# Altium project MU-RK3576J-MB.PrjPCB (part 6 of 13)

## Sheet VIDEO.SchDoc
size 420 x 297 mm; SheetNumber: 18; SheetTotal: 32; DocumentTypeShort: Э3; DocumentInvertoryNumber: ㅤ
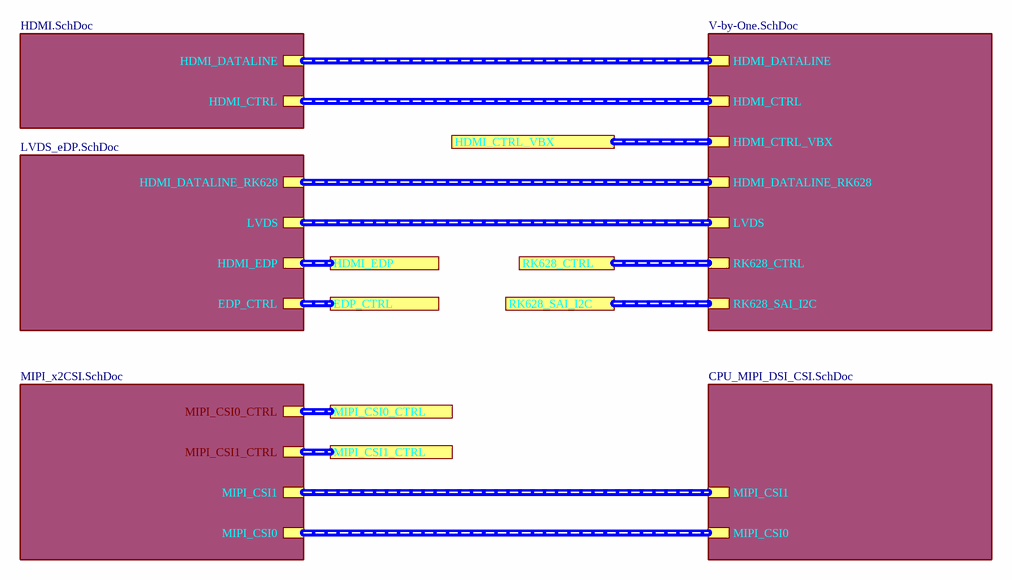
[diagram p14: VIDEO.SchDoc]

### Sub-sheets
CPU_MIPI_DSI_CSI = CPU_MIPI_DSI_CSI.SchDoc: MIPI_CSI1 (harness MIPI_CSI1), MIPI_CSI0 (harness MIPI_CSI0)
HDMI = HDMI.SchDoc: HDMI_DATALINE (harness HDMI_DATALINE), HDMI_CTRL (harness HDMI_CTRL)
LVDS_eDP = LVDS_eDP.SchDoc: LVDS (harness LVDS), HDMI_DATALINE_RK628 (harness HDMI_DATALINE_RK628), HDMI_EDP (harness HDMI_EDP), EDP_CTRL (harness EDP_CTRL)
MIPI_x2CSI = MIPI_x2CSI.SchDoc: MIPI_CSI1 (harness MIPI_CSI1), MIPI_CSI0 (harness MIPI_CSI0), MIPI_CSI0_CTRL (harness MIPI_CSI0_CTRL), MIPI_CSI1_CTRL (harness MIPI_CSI1_CTRL)
V-by-One.Sch = V-by-One.SchDoc: HDMI_CTRL (harness HDMI_CTRL), HDMI_DATALINE (harness HDMI_DATALINE), HDMI_CTRL_VBX (harness HDMI_CTRL_VBX), LVDS (harness LVDS), HDMI_DATALINE_RK628 (harness HDMI_DATALINE_RK628), RK628_SAI_I2C (harness RK628_SAI_I2C), RK628_CTRL (harness RK628_CTRL)

### Ports
EDP_CTRL, HDMI_CTRL_VBX, HDMI_EDP, MIPI_CSI0_CTRL, MIPI_CSI1_CTRL, RK628_CTRL, RK628_SAI_I2C

### Buses and harness runs
harness port EDP_CTRL = sheet LVDS_eDP/EDP_CTRL
harness port HDMI_CTRL_VBX = sheet V-by-One.Sch/HDMI_CTRL_VBX
harness port HDMI_EDP = sheet LVDS_eDP/HDMI_EDP
harness port MIPI_CSI0_CTRL = sheet MIPI_x2CSI/MIPI_CSI0_CTRL
harness port MIPI_CSI1_CTRL = sheet MIPI_x2CSI/MIPI_CSI1_CTRL
harness port RK628_CTRL = sheet V-by-One.Sch/RK628_CTRL
harness port RK628_SAI_I2C = sheet V-by-One.Sch/RK628_SAI_I2C
harness sheet CPU_MIPI_DSI_CSI/MIPI_CSI0 = sheet MIPI_x2CSI/MIPI_CSI0
harness sheet CPU_MIPI_DSI_CSI/MIPI_CSI1 = sheet MIPI_x2CSI/MIPI_CSI1
harness sheet HDMI/HDMI_CTRL = sheet V-by-One.Sch/HDMI_CTRL
harness sheet HDMI/HDMI_DATALINE = sheet V-by-One.Sch/HDMI_DATALINE
harness sheet LVDS_eDP/HDMI_DATALINE_RK628 = sheet V-by-One.Sch/HDMI_DATALINE_RK628
harness sheet LVDS_eDP/LVDS = sheet V-by-One.Sch/LVDS

### Notes on the sheet
- Подп. и дата
- Инв. № дубл.
- Взам. инв. №
- Инв. № подл.
- Изм.
- Лист
- № докум.
- Подп.
- Дата
- Копировал
- Формат А3

## Sheet HDMI.SchDoc
size 420 x 297 mm; Scale: 1:1; DocumentType: Схема электрическая принципиальная; SheetNumber: 19; SheetTotal: 32; DocumentTypeShort: Э3; DocumentInvertoryNumber: ㅤ
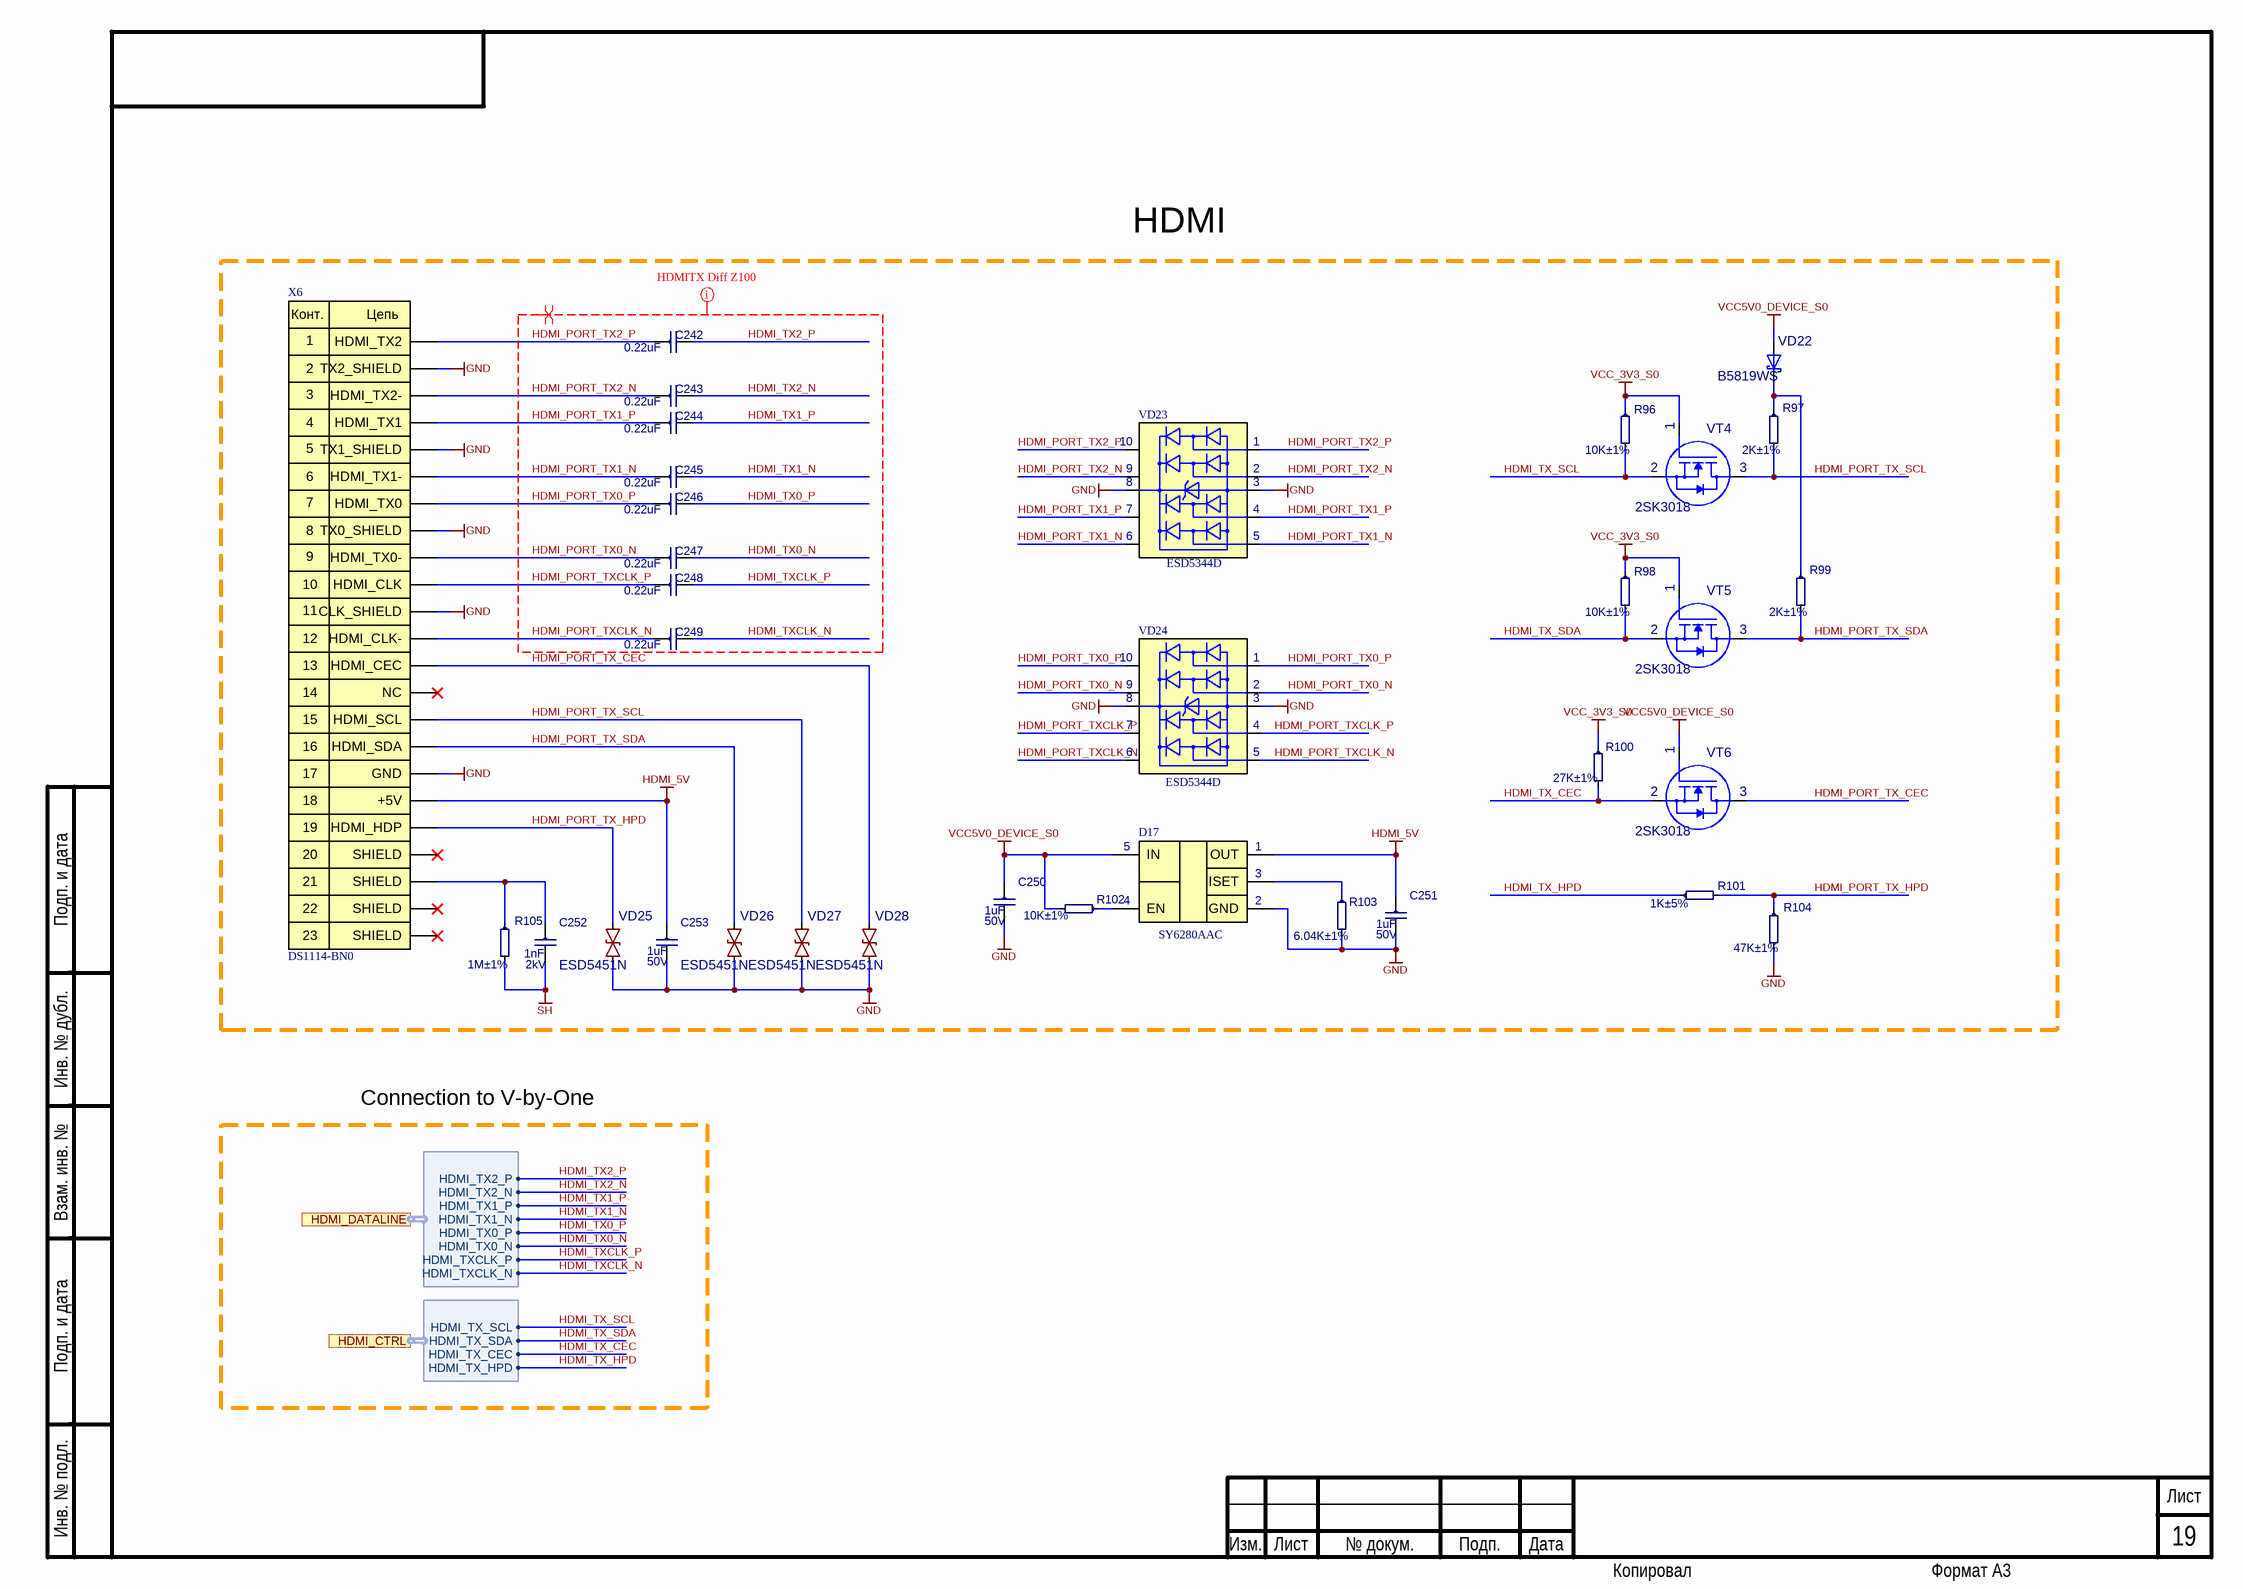
[diagram p15: HDMI.SchDoc]

### Parts
C242  0.22uF  [C0201]
C243  0.22uF  [C0201]
C244  0.22uF  [C0201]
C245  0.22uF  [C0201]
C246  0.22uF  [C0201]
C247  0.22uF  [C0201]
C248  0.22uF  [C0201]
C249  0.22uF  [C0201]
C250  1uF  Voltage: 50V  [C0402]
C251  1uF  Voltage: 50V  [C0402]
C252  1nF  Voltage: 2kV  [C1812]
C253  1uF  Voltage: 50V  [C0402]
D17  SY6280AAC  [SY6280AAC]
R96  10K±1%  [R0402]
R97  2K±1%  [R0402]
R98  10K±1%  [R0402]
R99  2K±1%  [R0402]
R100  27K±1%  [R0402]
R101  1K±5%  [R0402]
R102  10K±1%  [R0402]
R103  6.04K±1%  [R0402]
R104  47K±1%  [R0402]
R105  1M±1%  [R1206]
VD22  B5819WS  [B5819WS]
VD23  ESD5344D  [ESD5344D]
VD24  ESD5344D  [ESD5344D]
VD25  ESD5451N  [DFN_1006_2]
VD26  ESD5451N  [DFN_1006_2]
VD27  ESD5451N  [DFN_1006_2]
VD28  ESD5451N  [DFN_1006_2]
VT4  2SK3018  [2SK3018]
VT5  2SK3018  [2SK3018]
VT6  2SK3018  [2SK3018]
X6  DS1114-BN0  [DS1114-BN0]

### Ports
HDMI_CTRL (harness HDMI_CTRL), HDMI_DATALINE (harness HDMI_DATALINE)

### Harnesses
HDMI_DATALINE: HDMI_TX2_N, HDMI_TX1_P, HDMI_TX1_N, HDMI_TX2_P, HDMI_TX0_P, HDMI_TX0_N, HDMI_TXCLK_P, HDMI_TXCLK_N
HDMI_CTRL: HDMI_TX_SDA, HDMI_TX_CEC, HDMI_TX_HPD, HDMI_TX_SCL

### Nets
GND: C250.2 C251.2 C253.2 D17.2(GND) R103.2 R104.2 VD23.3 VD23.8 VD24.3 VD24.8 VD25.2 VD26.2 VD27.2 VD28.2 X6.2(TX2_SHIELD) X6.5(TX1_SHIELD) X6.8(TX0_SHIELD) X6.11(CLK_SHIELD) X6.17(GND)
HDMI_5V: C251.1 C253.1 D17.1(OUT) X6.18(+5V)
SH: C252.2 R105.2
VCC5V0_DEVICE_S0: C250.1 D17.5(IN) R102.2 VD22.2(A) VT6.1(G)
VCC_3V3_S0: R96.1 R98.1 R100.1 VT4.1(G) VT5.1(G)
HDMI_PORT_TX0_N: C247.1 VD24.2 VD24.9 X6.9(HDMI_TX0-)
HDMI_PORT_TX0_P: C246.1 VD24.1 VD24.10 X6.7(HDMI_TX0)
HDMI_PORT_TX1_N: C245.1 VD23.5 VD23.6 X6.6(HDMI_TX1-)
HDMI_PORT_TX1_P: C244.1 VD23.4 VD23.7 X6.4(HDMI_TX1)
HDMI_PORT_TX2_N: C243.1 VD23.2 VD23.9 X6.3(HDMI_TX2-)
HDMI_PORT_TX2_P: C242.1 VD23.1 VD23.10 X6.1(HDMI_TX2)
HDMI_PORT_TX_CEC: VD28.1 VT6.3(D) X6.13(HDMI_CEC)
HDMI_PORT_TX_HPD: R101.2 R104.1 VD25.1 X6.19(HDMI_HDP)
HDMI_PORT_TX_SCL: R97.2 VD27.1 VT4.3(D) X6.15(HDMI_SCL)
HDMI_PORT_TX_SDA: R99.2 VD26.1 VT5.3(D) X6.16(HDMI_SDA)
HDMI_PORT_TXCLK_N: C249.1 VD24.5 VD24.6 X6.12(HDMI_CLK-)
HDMI_PORT_TXCLK_P: C248.1 VD24.4 VD24.7 X6.10(HDMI_CLK)
HDMI_TX0_N: C247.2 ; port HDMI_DATALINE.HDMI_TX0_N
HDMI_TX0_P: C246.2 ; port HDMI_DATALINE.HDMI_TX0_P
HDMI_TX1_N: C245.2 ; port HDMI_DATALINE.HDMI_TX1_N
HDMI_TX1_P: C244.2 ; port HDMI_DATALINE.HDMI_TX1_P
HDMI_TX2_N: C243.2 ; port HDMI_DATALINE.HDMI_TX2_N
HDMI_TX2_P: C242.2 ; port HDMI_DATALINE.HDMI_TX2_P
HDMI_TX_CEC: R100.2 VT6.2(S) ; port HDMI_CTRL.HDMI_TX_CEC
HDMI_TX_HPD: R101.1 ; port HDMI_CTRL.HDMI_TX_HPD
HDMI_TX_SCL: R96.2 VT4.2(S) ; port HDMI_CTRL.HDMI_TX_SCL
HDMI_TX_SDA: R98.2 VT5.2(S) ; port HDMI_CTRL.HDMI_TX_SDA
HDMI_TXCLK_N: C249.2 ; port HDMI_DATALINE.HDMI_TXCLK_N
HDMI_TXCLK_P: C248.2 ; port HDMI_DATALINE.HDMI_TXCLK_P
NetC252_1: C252.1 R105.1 X6.21(SHIELD)
NetD17_3: D17.3(ISET) R103.1
NetD17_4: D17.4(EN) R102.1
NetR97_1: R97.1 R99.1 VD22.1(K)

Not connected (* = marked no-connect by the designer): X6 14(NC)* 20(SHIELD)* 22(SHIELD)* 23(SHIELD)*

### Layout directives
net class HDMITX: HDMI_PORT_TX0_N, HDMI_PORT_TX0_P, HDMI_PORT_TX1_N, HDMI_PORT_TX1_P, HDMI_PORT_TX2_N, HDMI_PORT_TX2_P, HDMI_PORT_TXCLK_N, HDMI_PORT_TXCLK_P, HDMI_TX0_N, HDMI_TX0_P, HDMI_TX1_N, HDMI_TX1_P, HDMI_TX2_N, HDMI_TX2_P, HDMI_TXCLK_N, HDMI_TXCLK_P
differential pair; differential pair class Diff_Z100: HDMI_PORT_TX0_N, HDMI_PORT_TX0_P, HDMI_PORT_TX1_N, HDMI_PORT_TX1_P, HDMI_PORT_TX2_N, HDMI_PORT_TX2_P, HDMI_PORT_TXCLK_N, HDMI_PORT_TXCLK_P, HDMI_TX0_N, HDMI_TX0_P, HDMI_TX1_N, HDMI_TX1_P, HDMI_TX2_N, HDMI_TX2_P, HDMI_TXCLK_N, HDMI_TXCLK_P

### Notes on the sheet
- HDMI
- Connection to V-by-One
- Подп. и дата
- Инв. № дубл.
- Взам. инв. №
- Инв. № подл.
- Изм.
- Лист
- № докум.
- Подп.
- Дата
- Копировал
- Формат А3
- (in symbol DS1114-BN0) Конт.; Цепь

### Library data of the parts
C242-C249 = 0201-C0G-25V-100pF±5%: *; Part Number: 0201-X5R-10V-220nF±10%; Manufacturer: Yageo; NameFromManufacturer: CC0201KRX5R6BB224; Dielectric: C0G; Voltage: 10V; Place: *); Tolerance: 5%; Check: False; Case: C0201; Value: 0.22uF; Temperature: -55°C~125°C; ComponentLink2Description: Link to datasheet; ComponentLink1Description: DATASHEET; ComponentLink2URL: https://ru.mouser.com/ProductDetail/YAGEO/CC0201JRNPO8BN101?qs=%2Fha2pyFaduhl6p6a7Jtfij5kOT7C0BCbN0eDEcSOi5wWtTVDmUsGTw%3D%3D; ComponentLink1URL: Datasheets/capacitors/UPY-GP_NP0_16V-to-50V_18.pdf; Last changed: 27.10.2022
C250 C251 C253 = 0402-X5R-50V-1uF±10%: Ceramic Capacitor 0402 1uF ±10% 50V X5R; Manufacturer: Yageo; NameFromManufacturer: CC0402KRX5R9BB105; Place: *); Check: False; Dielectric: X5R; Case: C0402; Part Number: 0402-X5R-50V-1uF±10%; Value: 1uF; Tolerance: 10%; Temperature: -55°C~85°C; ComponentLink2Description: Link to datasheet; ComponentLink1Description: DATASHEET; ComponentLink2URL: https://www.lcsc.com/product-detail/Multilayer-Ceramic-Capacitors-MLCC-SMD-SMT_YAGEO-CC0402KRX5R9BB105_C7500380.html; Last changed: 09.04.2025
C252 = 1812-C0G-2kV-1uF±10%: *; Part Number: 1812-C0G-2kV-1nF±10%; Manufacturer: FH; NameFromManufacturer: 1812B102K202NT; Dielectric: C0G; Place: *); Tolerance: 5%; Check: False; Case: CASE; Value: 1nF; Temperature: -55°C~125°C; ComponentLink2Description: Link to datasheet; ComponentLink1Description: DATASHEET; ComponentLink2URL: https://octopart.com/1812ga102jat2a-avx-75165070?r=sp; ComponentLink1URL: Datasheets/capacitors/C0GNP0-Dielectric.pdf; Last changed: 27.10.2022
D17 = SY6280AAC: Power Distribution Switches; Manufacturer: Silergy Corp; Check: False; Part Number: SY6280AAC; NameFromManufacturer: SY6280AAC; Value: SY6280AAC; ComponentLink1Description: DATASHEET; Last changed: 24.03.2023
R96 R98 R102 = 0402-0.0625W-10K-100ppm±1%: as R2 on sheet IC_LPDDR4; Case: R0402; Part Number: 0402-0.0625W-10K-100ppm±1%; Tolerance: 1%; Temperature: -55°C~155°C; ComponentLink1Description: DATASHEET; ComponentLink1URL: https://ru.mouser.com/ProductDetail/YAGEO/RC0402FR-0710KL?qs=%2Fha2pyFaduhjtLcYvKXQ8IogF7YwN7YtH%252BOO8ZtEEMnoa4yoWYcwpw%3D%3D; Datasheet: Datasheets/resistors/PYu-RC_Group_51_RoHS_L_11.pdf; Last changed: 27.10.2022
R97 R99 = 0402-0.0625W-2K-100ppm±1%: NameFromManufacturer: RC0402FR-072KL; Manufacturer: Yageo; Place: *); Value: 2K; Tolerance: 1%; Check: False; Case: R0402; Part Number: 0402-0.0625W-2K-100ppm±1%; Temperature: -55°C~155°C; ComponentLink1Description: DATASHEET; ComponentLink1URL: https://ru.mouser.com/ProductDetail/YAGEO/RC0402FR-072KL?qs=%2Fha2pyFaduhjtLcYvKXQ8CqCkWjwqUqgtfrQweQcV7%252BeDonvCaUsqQ%3D%3D; Datasheet: Datasheets/resistors/PYu-RC_Group_51_RoHS_L_11.pdf; Last changed: 27.10.2022
R100 = 0402-0.0625W-27K-100ppm±1%: NameFromManufacturer: RC0402FR-0727KL; Manufacturer: Yageo; Place: *); Value: 27K; Tolerance: 1%; Check: False; Case: R0402; Part Number: 0402-0.0625W-27K-100ppm±1%; Temperature: -55°C~155°C; ComponentLink1Description: DATASHEET; ComponentLink1URL: https://eu.mouser.com/ProductDetail/YAGEO/RC0402FR-0727KL?qs=UOUeRUa%252B8Wnc61O5LQjN8Q%3D%3D; Datasheet: Datasheets/resistors/PYu-RC_Group_51_RoHS_L_11.pdf; Last changed: 27.10.2022
R101 = 0402-0.0625W-1K-100ppm±5%: as R68 on sheet Flash_eMMC_MicroSD; Case: R0402; Part Number: 0402-0.0625W-1K-100ppm±5%; Temperature: -55°C~155°C; ComponentLink1Description: DATASHEET; ComponentLink1URL: https://ru.mouser.com/ProductDetail/YAGEO/RC0402JR-071KL?qs=%2Fha2pyFadugNN0LzwXn2qBG%2Fxv0pCy6gh7Z%252B1hZJT2CnjLeHVORGDQ%3D%3D; Datasheet: Datasheets/resistors/PYu-RC_Group_51_RoHS_L_11.pdf; Last changed: 27.10.2022
R103 = 0402-0.0625W-6.04K-100ppm±1%: NameFromManufacturer: RC0402FR-076K04L; Manufacturer: Yageo; Place: *); Value: 6.04K; Tolerance: 1%; Check: False; Case: R0402; Part Number: 0402-0.0625W-6.04K-100ppm±1%; Temperature: -55°C~155°C; ComponentLink1Description: DATASHEET; ComponentLink1URL: https://www.electronshik.ru/item/YAG/RC0402FR-076K04L; Datasheet: Datasheets/resistors/PYu-RC_Group_51_RoHS_L_11.pdf; Last changed: 18.11.2022
R104 = 0402-0.0625W-47K-100ppm±1%: as R70 on sheet Flash_eMMC_MicroSD; Case: R0402; Part Number: 0402-0.0625W-47K-100ppm±1%; Temperature: -55°C~155°C; ComponentLink1Description: DATASHEET; ComponentLink1URL: https://www.terraelectronica.ru/pdf/show?pdf_file=%252Fds%252Fpdf%252FR%252FRC0402.pdf; Datasheet: Datasheets/resistors/PYu-RC_Group_51_RoHS_L_12.pdf; Last changed: 27.10.2022
R105 = 1206-0.25W-1M-100ppm±1%: Chip Resistor 1206 1MΩ ±1% 200V ±100ppm/℃ Thick Film; NameFromManufacturer: RC1206FR-071ML; Manufacturer: Yageo; Place: *); Value: 1M; Check: False; Case: R1206; Part Number: 1206-0.25W-1M-100ppm±1%; Tolerance: 1%; Temperature: -55°C~155°C; ComponentLink1Description: DATASHEET; ComponentLink1URL: https://www.lcsc.com/product-detail/Chip-Resistor-Surface-Mount_YAGEO-RC1206FR-071ML_C108083.html?s_z=n_RC1206FR-071ML; Last changed: 09.04.2025
VD22 = B5819WS: Manufacturer: MDD; Check: False; Part Number: B5819WS; Value: B5819WS; NameFromManufacturer: B5819WS
VD23 VD24 = ESD5344D: Manufacturer: KUU; Check: False; Part Number: ESD5344D; Value: ESD5344D; NameFromManufacturer: ESD5344D
VD25-VD28 = ESD5451N: as VD11 on sheet Flash_eMMC_MicroSD; Part Number: ESD5451N; Value: ESD5451N; Temperature: -65°C~150°C; ComponentLink1Description: DATASHEET; NameFromManufacturer: ESD5451N; Last changed: 13.04.2023
VT4-VT6 = 2SK3018: N-Channel; Manufacturer: KUU; Check: False; Part Number: 2SK3018; Value: 2SK3018; NameFromManufacturer: 2SK3018
X6 = DS1114-BN0: Manufacturer: CONNFLY; Check: False; Part Number: DS1114-BN0; NameFromManufacturer: DS1114-BN0; Value: DS1114-BN0

## Sheet CPU_MIPI_DSI_CSI.SchDoc
size 420 x 297 mm; Scale: 1:1; DocumentType: Схема электрическая принципиальная; SheetNumber: 20; SheetTotal: 32; DocumentTypeShort: Э3; DocumentInvertoryNumber: ㅤ
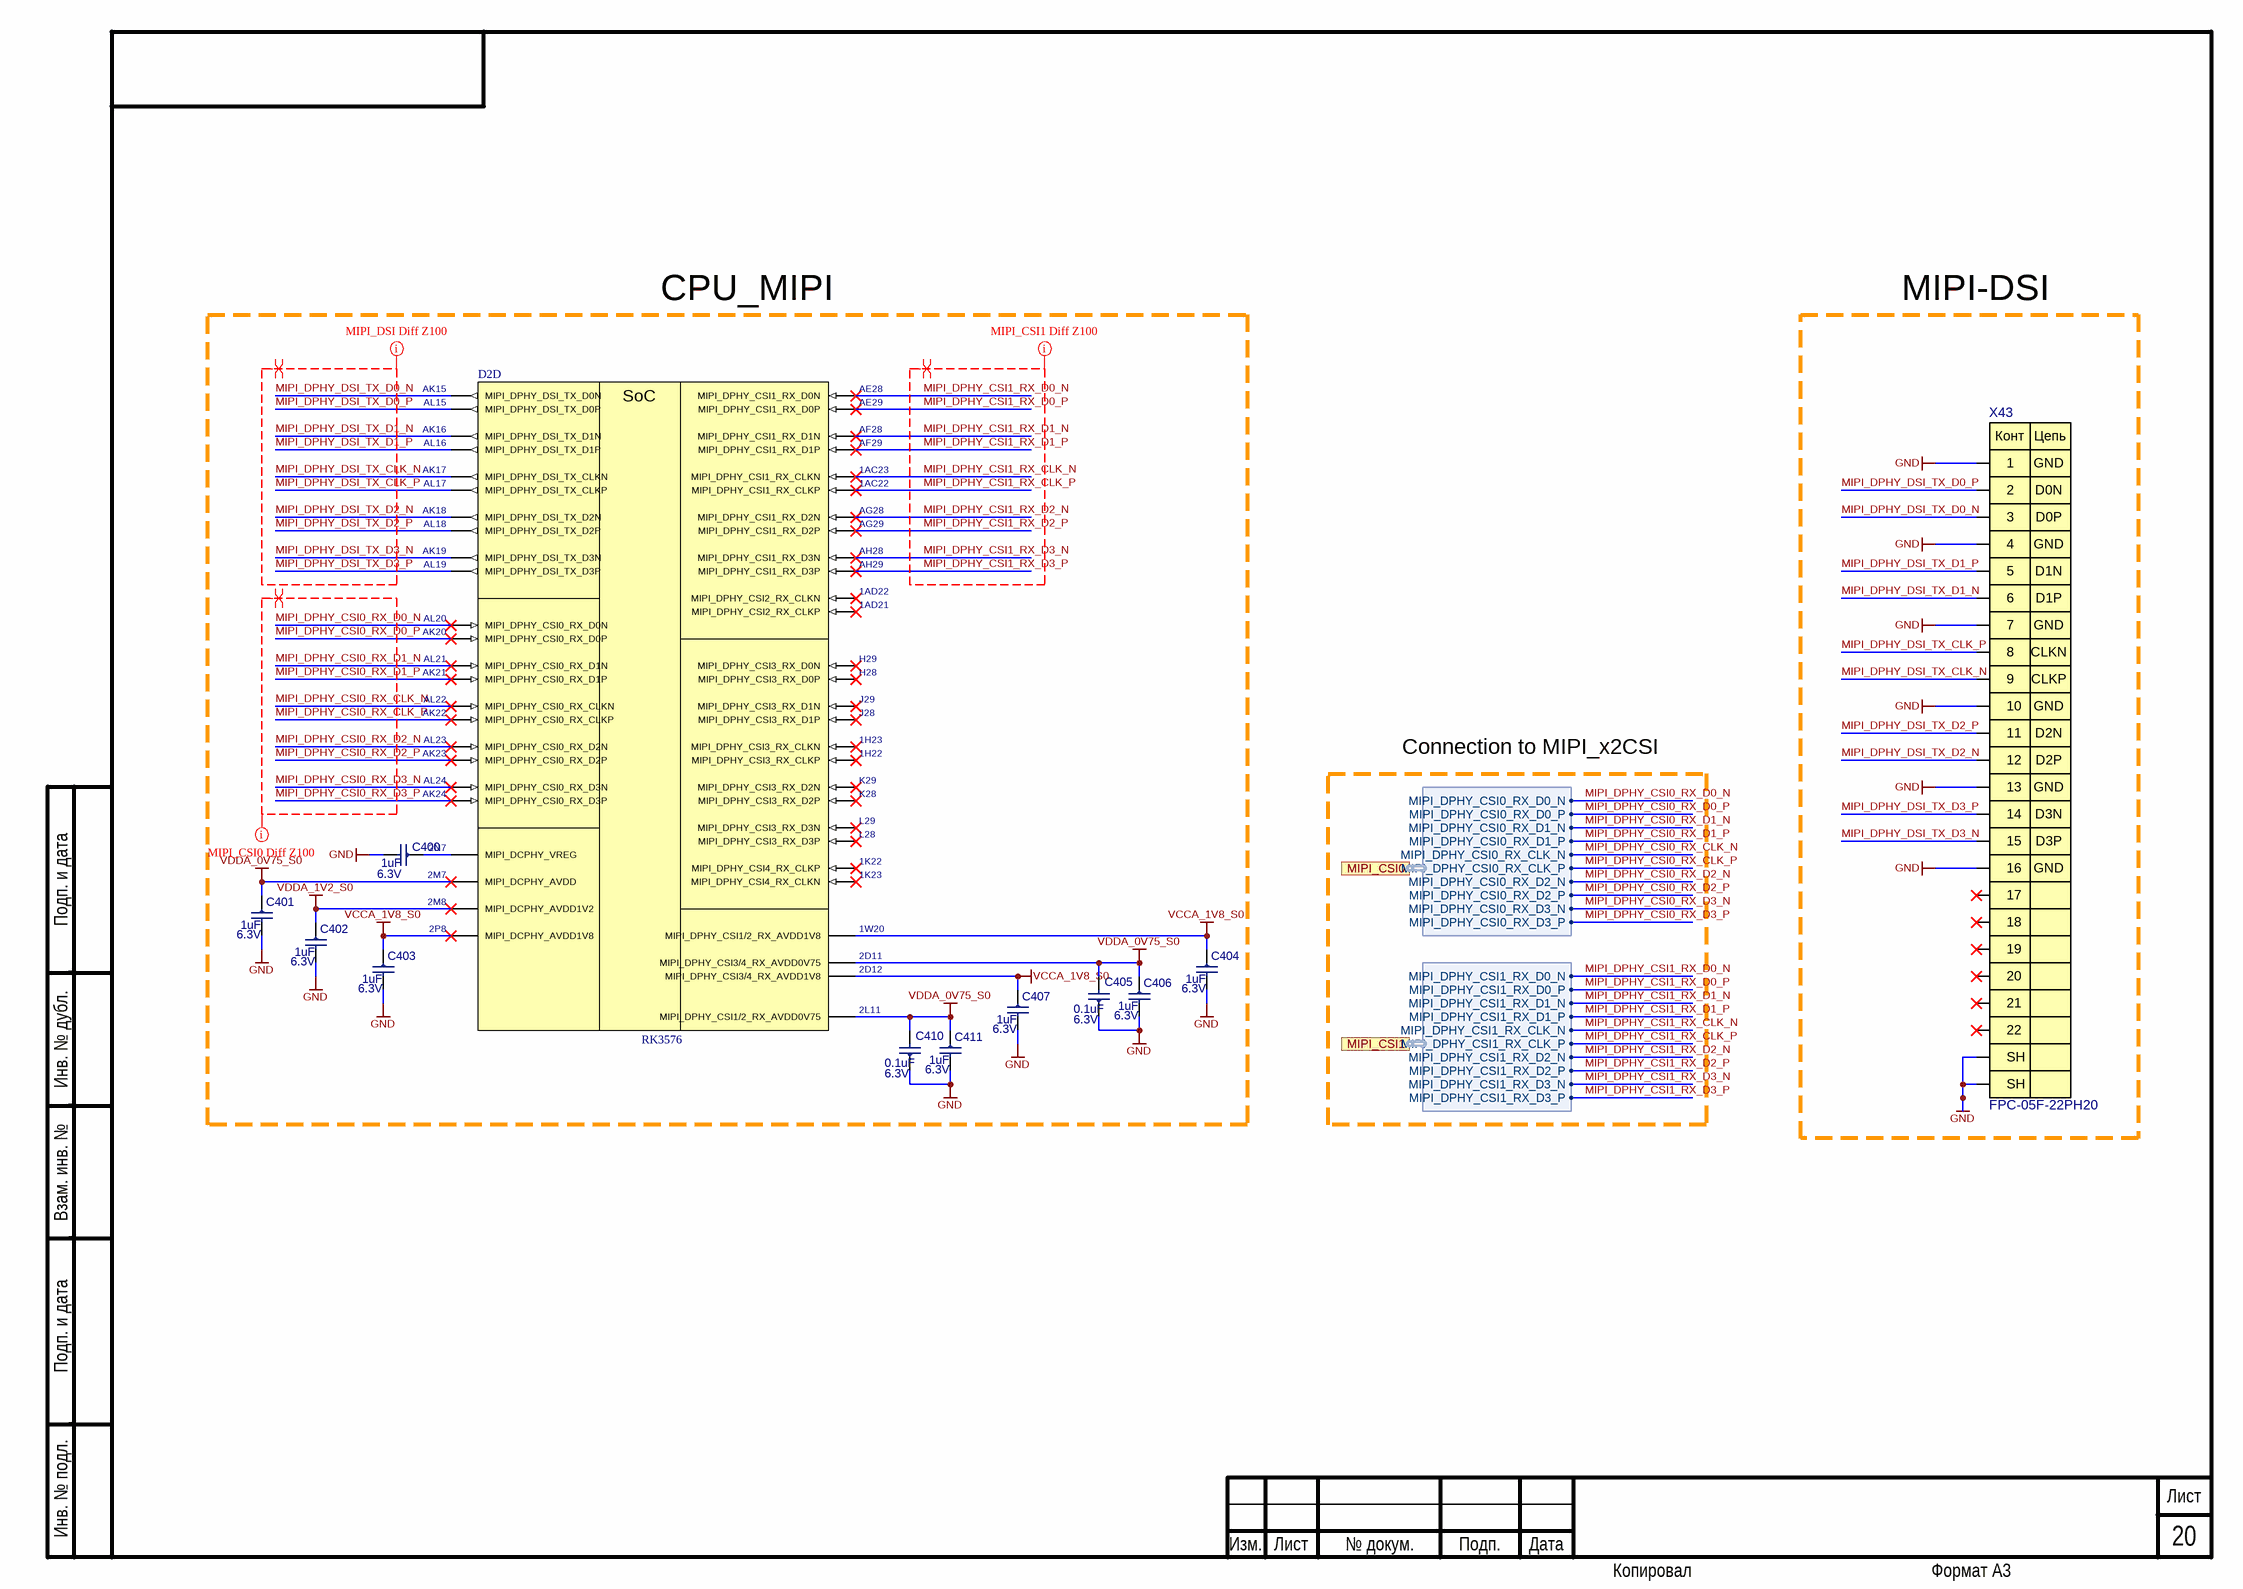
[diagram p16: CPU_MIPI_DSI_CSI.SchDoc]

### Parts
C400  1uF  Voltage: 6.3V  [C0201]
C401  1uF  Voltage: 6.3V  [C0201]
C402  1uF  Voltage: 6.3V  [C0201]
C403  1uF  Voltage: 6.3V  [C0201]
C404  1uF  Voltage: 6.3V  [C0201]
C405  0.1uF  Voltage: 6.3V  [C0201]
C406  1uF  Voltage: 6.3V  [C0201]
C407  1uF  Voltage: 6.3V  [C0201]
C410  0.1uF  Voltage: 6.3V  [C0201]
C411  1uF  Voltage: 6.3V  [C0201]
D2  RK3576  [BGAFCCSP698L]  (part D of 7)
X43  FPC-05F-22PH20  [FPC-05F-22PH20]

### Ports
MIPI_CSI0 (harness MIPI_CSI0), MIPI_CSI1 (harness MIPI_CSI1)

### Harnesses
MIPI_CSI1: MIPI_DPHY_CSI1_RX_D3_P, MIPI_DPHY_CSI1_RX_D3_N, MIPI_DPHY_CSI1_RX_D2_P, MIPI_DPHY_CSI1_RX_D2_N, MIPI_DPHY_CSI1_RX_CLK_P, MIPI_DPHY_CSI1_RX_CLK_N, MIPI_DPHY_CSI1_RX_D1_P, MIPI_DPHY_CSI1_RX_D1_N, MIPI_DPHY_CSI1_RX_D0_P, MIPI_DPHY_CSI1_RX_D0_N
MIPI_CSI0: MIPI_DPHY_CSI0_RX_D3_P, MIPI_DPHY_CSI0_RX_D3_N, MIPI_DPHY_CSI0_RX_D2_P, MIPI_DPHY_CSI0_RX_D2_N, MIPI_DPHY_CSI0_RX_CLK_P, MIPI_DPHY_CSI0_RX_CLK_N, MIPI_DPHY_CSI0_RX_D1_P, MIPI_DPHY_CSI0_RX_D1_N, MIPI_DPHY_CSI0_RX_D0_P, MIPI_DPHY_CSI0_RX_D0_N

### Nets
GND: C400.2 C401.2 C402.2 C403.2 C404.2 C405.1 C406.2 C407.2 C410.1 C411.2 X43.1 X43.4 X43.7 X43.10 X43.13 X43.16 X43.23(SH) X43.24(SH)
VCCA_1V8_S0: C403.1 C404.1 C407.1 D2.1W20(MIPI_DPHY_CSI1/2_RX_AVDD1V8) D2.2D12(MIPI_DPHY_CSI3/4_RX_AVDD1V8) D2.2P8(MIPI_DCPHY_AVDD1V8)
VDDA_0V75_S0: C401.1 C405.2 C406.1 C410.2 C411.1 D2.2D11(MIPI_DPHY_CSI3/4_RX_AVDD0V75) D2.2L11(MIPI_DPHY_CSI1/2_RX_AVDD0V75) D2.2M7(MIPI_DCPHY_AVDD)
VDDA_1V2_S0: C402.1 D2.2M8(MIPI_DCPHY_AVDD1V2)
MIPI_DPHY_CSI0_RX_CLK_N: D2.AL22(MIPI_DPHY_CSI0_RX_CLKN) ; port MIPI_CSI0.MIPI_DPHY_CSI0_RX_CLK_N
MIPI_DPHY_CSI0_RX_CLK_P: D2.AK22(MIPI_DPHY_CSI0_RX_CLKP) ; port MIPI_CSI0.MIPI_DPHY_CSI0_RX_CLK_P
MIPI_DPHY_CSI0_RX_D0_N: D2.AL20(MIPI_DPHY_CSI0_RX_D0N) ; port MIPI_CSI0.MIPI_DPHY_CSI0_RX_D0_N
MIPI_DPHY_CSI0_RX_D0_P: D2.AK20(MIPI_DPHY_CSI0_RX_D0P) ; port MIPI_CSI0.MIPI_DPHY_CSI0_RX_D0_P
MIPI_DPHY_CSI0_RX_D1_N: D2.AL21(MIPI_DPHY_CSI0_RX_D1N) ; port MIPI_CSI0.MIPI_DPHY_CSI0_RX_D1_N
MIPI_DPHY_CSI0_RX_D1_P: D2.AK21(MIPI_DPHY_CSI0_RX_D1P) ; port MIPI_CSI0.MIPI_DPHY_CSI0_RX_D1_P
MIPI_DPHY_CSI0_RX_D2_N: D2.AL23(MIPI_DPHY_CSI0_RX_D2N) ; port MIPI_CSI0.MIPI_DPHY_CSI0_RX_D2_N
MIPI_DPHY_CSI0_RX_D2_P: D2.AK23(MIPI_DPHY_CSI0_RX_D2P) ; port MIPI_CSI0.MIPI_DPHY_CSI0_RX_D2_P
MIPI_DPHY_CSI0_RX_D3_N: D2.AL24(MIPI_DPHY_CSI0_RX_D3N) ; port MIPI_CSI0.MIPI_DPHY_CSI0_RX_D3_N
MIPI_DPHY_CSI0_RX_D3_P: D2.AK24(MIPI_DPHY_CSI0_RX_D3P) ; port MIPI_CSI0.MIPI_DPHY_CSI0_RX_D3_P
MIPI_DPHY_CSI1_RX_CLK_N: D2.1AC23(MIPI_DPHY_CSI1_RX_CLKN) ; port MIPI_CSI1.MIPI_DPHY_CSI1_RX_CLK_N
MIPI_DPHY_CSI1_RX_CLK_P: D2.1AC22(MIPI_DPHY_CSI1_RX_CLKP) ; port MIPI_CSI1.MIPI_DPHY_CSI1_RX_CLK_P
MIPI_DPHY_CSI1_RX_D0_N: D2.AE28(MIPI_DPHY_CSI1_RX_D0N) ; port MIPI_CSI1.MIPI_DPHY_CSI1_RX_D0_N
MIPI_DPHY_CSI1_RX_D0_P: D2.AE29(MIPI_DPHY_CSI1_RX_D0P) ; port MIPI_CSI1.MIPI_DPHY_CSI1_RX_D0_P
MIPI_DPHY_CSI1_RX_D1_N: D2.AF28(MIPI_DPHY_CSI1_RX_D1N) ; port MIPI_CSI1.MIPI_DPHY_CSI1_RX_D1_N
MIPI_DPHY_CSI1_RX_D1_P: D2.AF29(MIPI_DPHY_CSI1_RX_D1P) ; port MIPI_CSI1.MIPI_DPHY_CSI1_RX_D1_P
MIPI_DPHY_CSI1_RX_D2_N: D2.AG28(MIPI_DPHY_CSI1_RX_D2N) ; port MIPI_CSI1.MIPI_DPHY_CSI1_RX_D2_N
MIPI_DPHY_CSI1_RX_D2_P: D2.AG29(MIPI_DPHY_CSI1_RX_D2P) ; port MIPI_CSI1.MIPI_DPHY_CSI1_RX_D2_P
MIPI_DPHY_CSI1_RX_D3_N: D2.AH28(MIPI_DPHY_CSI1_RX_D3N) ; port MIPI_CSI1.MIPI_DPHY_CSI1_RX_D3_N
MIPI_DPHY_CSI1_RX_D3_P: D2.AH29(MIPI_DPHY_CSI1_RX_D3P) ; port MIPI_CSI1.MIPI_DPHY_CSI1_RX_D3_P
MIPI_DPHY_DSI_TX_CLK_N: D2.AK17(MIPI_DPHY_DSI_TX_CLKN) X43.9
MIPI_DPHY_DSI_TX_CLK_P: D2.AL17(MIPI_DPHY_DSI_TX_CLKP) X43.8
MIPI_DPHY_DSI_TX_D0_N: D2.AK15(MIPI_DPHY_DSI_TX_D0N) X43.3
MIPI_DPHY_DSI_TX_D0_P: D2.AL15(MIPI_DPHY_DSI_TX_D0P) X43.2
MIPI_DPHY_DSI_TX_D1_N: D2.AK16(MIPI_DPHY_DSI_TX_D1N) X43.6
MIPI_DPHY_DSI_TX_D1_P: D2.AL16(MIPI_DPHY_DSI_TX_D1P) X43.5
MIPI_DPHY_DSI_TX_D2_N: D2.AK18(MIPI_DPHY_DSI_TX_D2N) X43.12
MIPI_DPHY_DSI_TX_D2_P: D2.AL18(MIPI_DPHY_DSI_TX_D2P) X43.11
MIPI_DPHY_DSI_TX_D3_N: D2.AK19(MIPI_DPHY_DSI_TX_D3N) X43.15
MIPI_DPHY_DSI_TX_D3_P: D2.AL19(MIPI_DPHY_DSI_TX_D3P) X43.14
NetC400_1: C400.1 D2.2N7(MIPI_DCPHY_VREG)

Not connected (* = marked no-connect by the designer): D2 1AD21(MIPI_DPHY_CSI2_RX_CLKP)* 1AD22(MIPI_DPHY_CSI2_RX_CLKN)* 1H22(MIPI_DPHY_CSI3_RX_CLKP)* 1H23(MIPI_DPHY_CSI3_RX_CLKN)* 1K22(MIPI_DPHY_CSI4_RX_CLKP)* 1K23(MIPI_DPHY_CSI4_RX_CLKN)* H28(MIPI_DPHY_CSI3_RX_D0P)* H29(MIPI_DPHY_CSI3_RX_D0N)* J28(MIPI_DPHY_CSI3_RX_D1P)* J29(MIPI_DPHY_CSI3_RX_D1N)* K28(MIPI_DPHY_CSI3_RX_D2P)* K29(MIPI_DPHY_CSI3_RX_D2N)* L28(MIPI_DPHY_CSI3_RX_D3P)* L29(MIPI_DPHY_CSI3_RX_D3N)*; X43 17* 18* 19* 20* 21* 22*

### Layout directives
net class MIPI_CSI1: MIPI_DPHY_CSI1_RX_CLK_N, MIPI_DPHY_CSI1_RX_CLK_P, MIPI_DPHY_CSI1_RX_D0_N, MIPI_DPHY_CSI1_RX_D0_P, MIPI_DPHY_CSI1_RX_D1_N, MIPI_DPHY_CSI1_RX_D1_P, MIPI_DPHY_CSI1_RX_D2_N, MIPI_DPHY_CSI1_RX_D2_P, MIPI_DPHY_CSI1_RX_D3_N, MIPI_DPHY_CSI1_RX_D3_P
net class MIPI_DSI: MIPI_DPHY_DSI_TX_CLK_N, MIPI_DPHY_DSI_TX_CLK_P, MIPI_DPHY_DSI_TX_D0_N, MIPI_DPHY_DSI_TX_D0_P, MIPI_DPHY_DSI_TX_D1_N, MIPI_DPHY_DSI_TX_D1_P, MIPI_DPHY_DSI_TX_D2_N, MIPI_DPHY_DSI_TX_D2_P, MIPI_DPHY_DSI_TX_D3_N, MIPI_DPHY_DSI_TX_D3_P
net class MIPI_CSI0: MIPI_DPHY_CSI0_RX_CLK_N, MIPI_DPHY_CSI0_RX_CLK_P, MIPI_DPHY_CSI0_RX_D0_N, MIPI_DPHY_CSI0_RX_D0_P, MIPI_DPHY_CSI0_RX_D1_N, MIPI_DPHY_CSI0_RX_D1_P, MIPI_DPHY_CSI0_RX_D2_N, MIPI_DPHY_CSI0_RX_D2_P, MIPI_DPHY_CSI0_RX_D3_N, MIPI_DPHY_CSI0_RX_D3_P
differential pair; differential pair class Diff_Z100: MIPI_DPHY_CSI0_RX_CLK_N, MIPI_DPHY_CSI0_RX_CLK_P, MIPI_DPHY_CSI0_RX_D0_N, MIPI_DPHY_CSI0_RX_D0_P, MIPI_DPHY_CSI0_RX_D1_N, MIPI_DPHY_CSI0_RX_D1_P, MIPI_DPHY_CSI0_RX_D2_N, MIPI_DPHY_CSI0_RX_D2_P, MIPI_DPHY_CSI0_RX_D3_N, MIPI_DPHY_CSI0_RX_D3_P, MIPI_DPHY_CSI1_RX_CLK_N, MIPI_DPHY_CSI1_RX_CLK_P, MIPI_DPHY_CSI1_RX_D0_N, MIPI_DPHY_CSI1_RX_D0_P, MIPI_DPHY_CSI1_RX_D1_N, MIPI_DPHY_CSI1_RX_D1_P, MIPI_DPHY_CSI1_RX_D2_N, MIPI_DPHY_CSI1_RX_D2_P, MIPI_DPHY_CSI1_RX_D3_N, MIPI_DPHY_CSI1_RX_D3_P, MIPI_DPHY_DSI_TX_CLK_N, MIPI_DPHY_DSI_TX_CLK_P, MIPI_DPHY_DSI_TX_D0_N, MIPI_DPHY_DSI_TX_D0_P, MIPI_DPHY_DSI_TX_D1_N, MIPI_DPHY_DSI_TX_D1_P, MIPI_DPHY_DSI_TX_D2_N, MIPI_DPHY_DSI_TX_D2_P, MIPI_DPHY_DSI_TX_D3_N, MIPI_DPHY_DSI_TX_D3_P

### Notes on the sheet
- CPU_MIPI
- MIPI-DSI
- (near X43) GND
- (near X43) D0N
- (near X43) D0P
- (near X43) D1N
- (near X43) D1P
- (near X43) CLKN
- (near X43) CLKP
- (near X43) D2N
- Connection to MIPI_x2CSI
- (near X43) D2P
- (near X43) D3N
- (near X43) D3P
- Подп. и дата
- Инв. № дубл.
- Взам. инв. №
- Инв. № подл.
- Изм.
- Лист
- № докум.
- Подп.
- Дата
- Копировал
- Формат А3
- (in symbol FPC-05F-22PH20) Конт; Цепь
- (in symbol RK3576, part D) SoC

### Library data of the parts
C400-C404 C406 C407 C411 = 0201-X5R-6.3V-1uF±20%: as C254-C259 on sheet CPU_GPIO; Case: C0201; Part Number: 0201-X5R-6.3V-1uF±20%; Value: 1uF; Temperature: -55°C~85°C; ComponentLink2Description: Link to datasheet; ComponentLink1Description: DATASHEET; ComponentLink2URL: https://www.terraelectronica.ru/product/1209278; ComponentLink1URL: Datasheets/capacitors/GRM033R60J105MEA2-61A.pdf; Last changed: 27.10.2022
C405 C410 = 0201-X5R-6.3V-0.1uF±10%: as C260-C264 on sheet CPU_GPIO; Case: C0201; Part Number: 0201-X5R-6.3V-0.1uF±10%; Value: 0.1uF; Temperature: -55°C~85°C; ComponentLink2Description: Link to datasheet; ComponentLink1Description: DATASHEET; ComponentLink2URL: https://www.terraelectronica.ru/product/1020032; ComponentLink1URL: Datasheets/capacitors/UPY-GPHC_X5R_4V-to-50V_27.pdf; Last changed: 27.10.2022
D2 = RK3576: as D2 on sheet CPU_GPIO; Part Number: RK3576; Temperature: -40°C~85°C; Value: RK3576; ComponentLink1Description: DATASHEET; NameFromManufacturer: RK3576; ComponentLink1URL: https://wiki.friendlyelec.com/wiki/images/b/bf/Rockchip_RK3576_Datasheet_V1.5-20241216.pdf; Last changed: 06.01.2026
X43 = FPC-05F-22PH20: FFC/FPC Connector 22 Position 0.5mm Pitch Bottom Contact Surface Mount, Right Angle -25℃~+85℃; Manufacturer: XUNPU; Check: False; Part Number: FPC-05F-22PH20; Value: FPC-05F-22PH20; NameFromManufacturer: FPC-05F-22PH20